# EAGLE schematic LEDLightSticks_V2--05--Wall_Pwr_to_Molex_PCB_v6 (EAGLE 9.7.0)
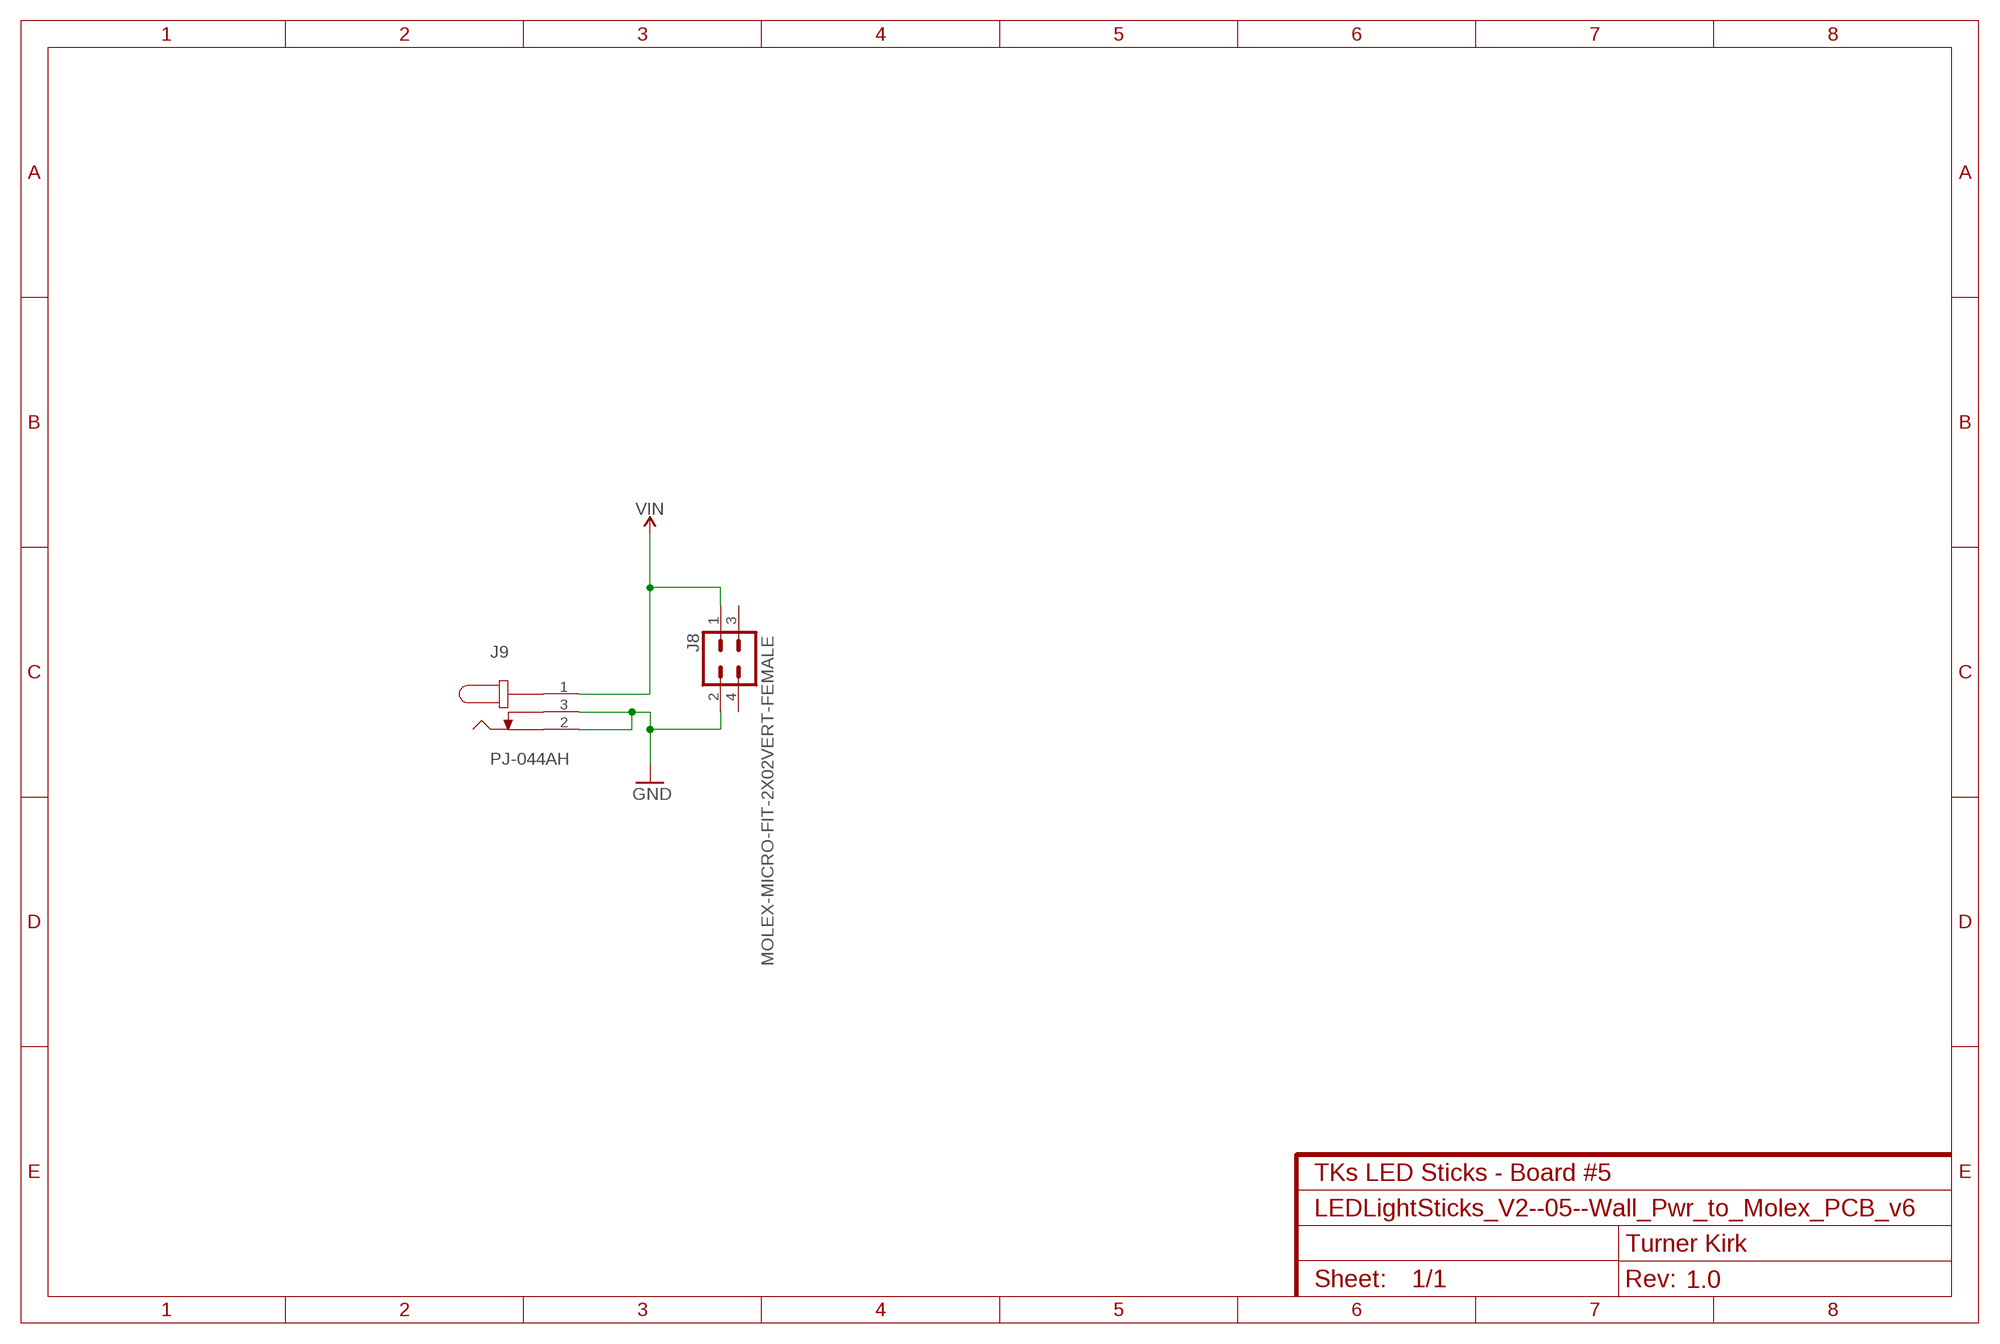
[diagram p0: schematic, sheet 1]
FRAME1 (FRAME-A4L): CNAME: TKs LED Sticks - Board #5; CREVISION: 1.0; DESIGNER: Turner Kirk

## Parts
J8  MOLEX-MICRO-FIT-2X02VERT-FEMALE  [MICROFIT_2X2_VERT_FEMALE]
J9  PJ-044AH  [CUI_PJ-044AH]

## Nets
GND: J8.2 J9.2 J9.3
VIN: J8.1 J9.1
Unconnected: J8.3 J8.4

## Library data of the parts
J8 = LED_Light_Sticks_Library:MOLEX-MICRO-FIT-2X02
J9 = LED_Light_Sticks_Library:PJ-044AH: 2.0 mm Center Pin, 5.0 A, Vertical, Through Hole, Dc Power Jack Connector; MANUFACTURER: CUI; PARTREV: 1.02; STANDARD: Manufacturer Recommendations